# EAGLE design vario_1 (EAGLE 7.5.0)
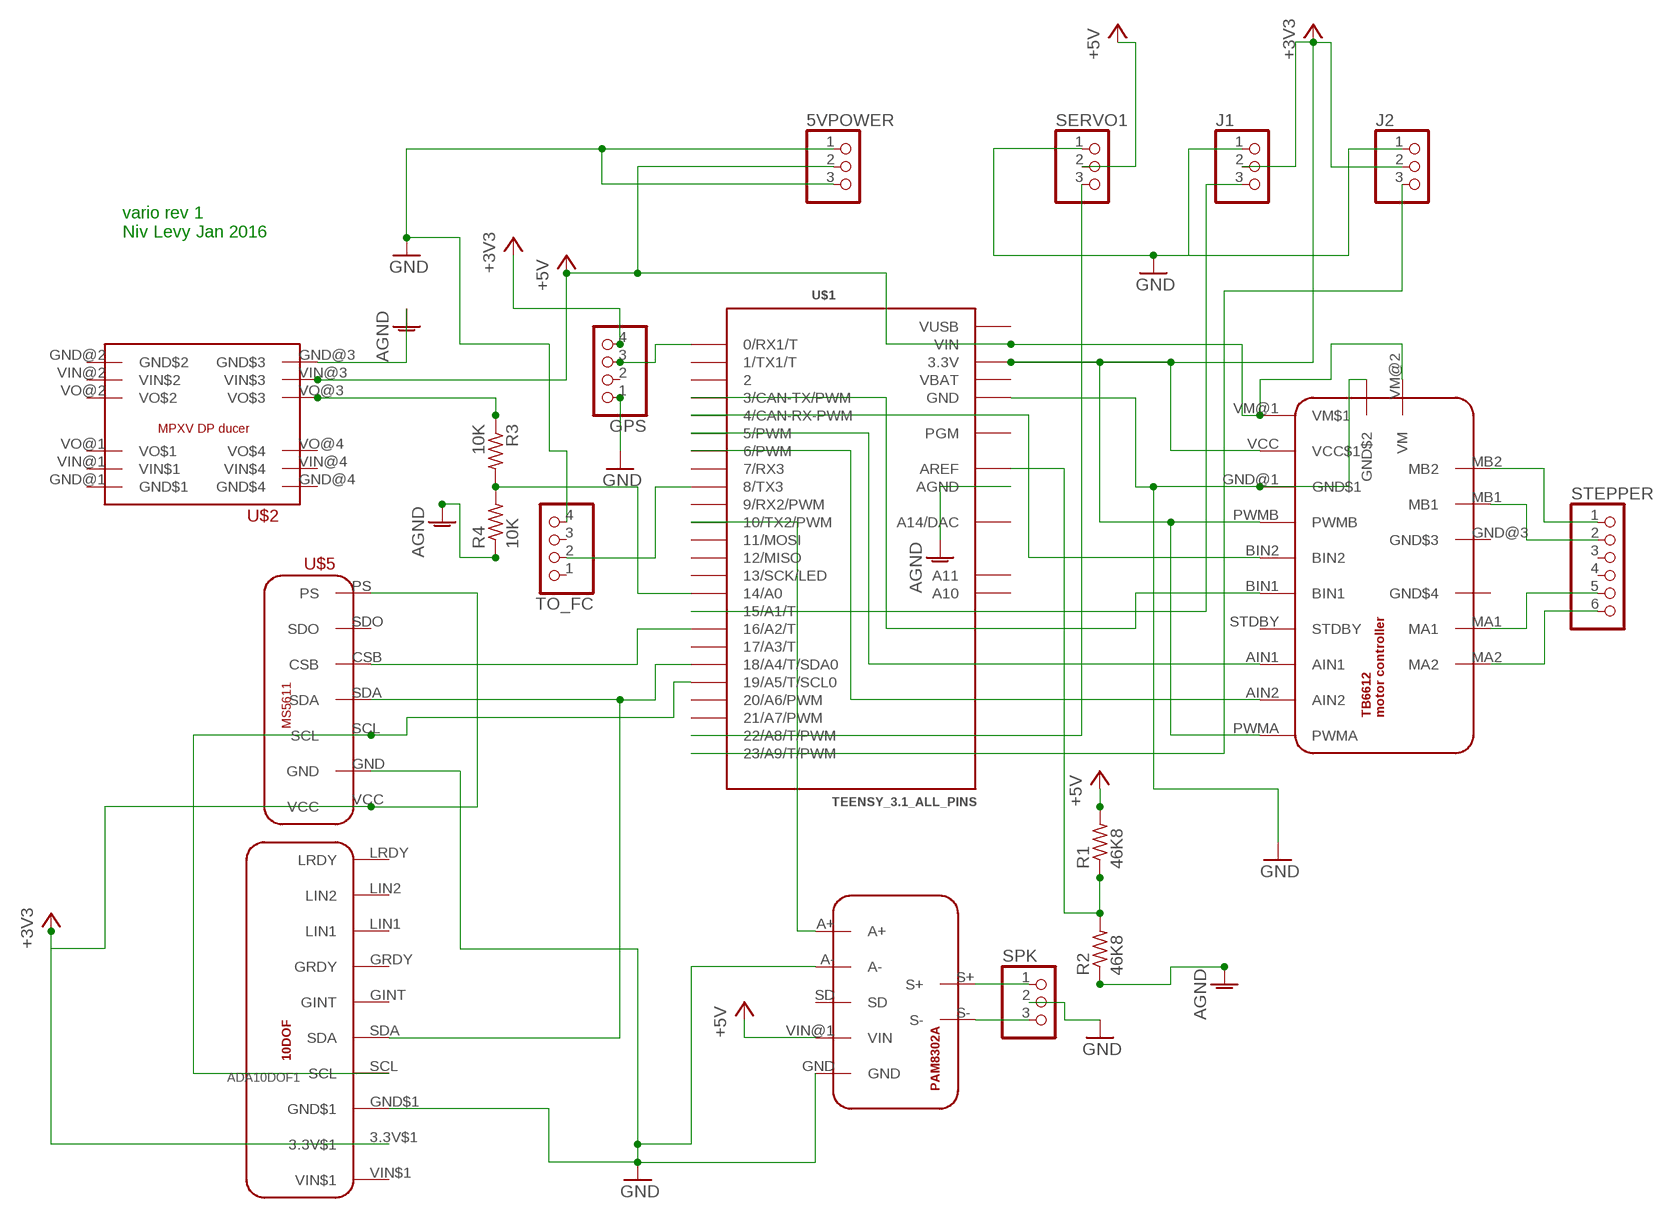
[diagram p0: schematic, sheet 1]

## Parts
5VPOWER  PINHD-1X3  [1X03]
ADA10DOF1  10DOF_BREAKOUT  [10_DOF_BREAKOUT]
GPS  PINHD-1X4  [1X04]
J1  PINHD-1X3  [1X03]
J2  PINHD-1X3  [1X03]
R1  46K8  R-US_0207/10  [0207/10]
R2  46K8  R-US_0207/10  [0207/10]
R3  10K  R-US_0207/10  [0207/10]
R4  10K  R-US_0207/10  [0207/10]
SERVO1  PINHD-1X3  [1X03]
SPK  PINHD-1X3  [1X03]
STEPPER  PINHD-1X6  [1X06]
TO_FC  PINHD-1X4  [1X04]
U$1  TEENSY_3.1_ALL_PINS  [TEENSY3-ALL_PINS]
U$2  MPXV  [MPXV]
U$3  TB6612_BREAKOUT  [TB6612_BREAKOUT]
U$4  PAM8302A_BREAKOUT  [PAM8302A_BREAKOUT]
U$5  MS5611_BREAKOUT  [MS5611_BREAKOUT]

## Nets
+3V3: ADA10DOF1.3.3V$1 GPS.4 J1.2 J2.2 U$1.3.3V U$1.3.3V1(3.3V) U$3.PWMA U$3.PWMB U$3.VCC(VCC$1) U$5.PS U$5.VCC
+5V: 5VPOWER.2 R1.2 SERVO1.2 U$1.VIN U$2.VIN@3(VIN$3) U$3.VM@1(VM$1) U$3.VM@2(VM) U$4.VIN@1(VIN)
AGND: R2.1 R4.1 U$1.AGND U$2.GND@3(GND$3)
GND: 5VPOWER.1 5VPOWER.3 ADA10DOF1.GND$1 GPS.1 J1.1 J2.1 SERVO1.1 SPK.2 TO_FC.4 U$1.GND U$1.GND1(GND) U$3.GND@1(GND$1) U$3.GND@2(GND$2) U$4.A- U$4.GND U$5.GND
N$1: STEPPER.1 U$3.MB2
N$2: STEPPER.2 U$3.MB1
N$3: STEPPER.6 U$3.MA2
N$4: STEPPER.5 U$3.MA1
N$5: U$1.16/A2(16/A2/T) U$5.CSB
N$8: U$1.6(6/PWM) U$3.AIN2
N$9: U$1.5(5/PWM) U$3.AIN1
N$10: U$1.4(4/CAN-RX-PWM) U$3.BIN2
N$11: U$1.3(3/CAN-TX/PWM) U$3.BIN1
N$12: ADA10DOF1.SDA U$1.18/A4(18/A4/T/SDA0) U$5.SDA
N$13: ADA10DOF1.SCL U$1.19/A5(19/A5/T/SCL0) U$5.SCL
N$14: R3.2 R4.2 U$1.14/A0
N$15: R1.1 R2.2 U$1.AREF
N$16: R3.1 U$2.VO@3(VO$3)
N$17: TO_FC.2 U$1.8(8/TX3)
N$18: U$1.10(10/TX2/PWM) U$4.A+
N$19: GPS.3 U$1.0(0/RX1/T)
N$20: SPK.1 U$4.S+
N$21: J1.3 U$1.15/A1(15/A1/T)
N$22: SERVO1.3 U$1.22/A8(22/A8/T/PWM)
N$23: J2.3 U$1.23/A9(23/A9/T/PWM)
N$24: SPK.3 U$4.S-
Unconnected: ADA10DOF1.GINT ADA10DOF1.GRDY ADA10DOF1.LIN1 ADA10DOF1.LIN2 ADA10DOF1.LRDY ADA10DOF1.VIN$1 GPS.2 STEPPER.3 STEPPER.4 TO_FC.1 TO_FC.3 U$1.1(1/TX1/T) U$1.2 U$1.7(7/RX3) U$1.9(9/RX2/PWM) U$1.11(11/MOSI) U$1.12(12/MISO) U$1.13(13/SCK/LED) U$1.17/A3(17/A3/T) U$1.20/A6(20/A6/PWM) U$1.21/A7(21/A7/PWM) U$1.A10 U$1.A11 U$1.PGM U$1.RESET/DAC(A14/DAC) U$2.GND@1(GND$1) U$2.GND@2(GND$2) U$2.GND@4(GND$4) U$2.VIN@1(VIN$1) U$2.VIN@2(VIN$2) U$2.VIN@4(VIN$4) U$2.VO@1(VO$1) U$2.VO@2(VO$2) U$2.VO@4(VO$4) U$3.GND@3(GND$3) U$3.GND@4(GND$4) U$3.STDBY U$4.SD U$5.SDO

## Notes on the sheet
- vario rev 1
  Niv Levy Jan 2016

## Power pins joined to a net without a drawn wire
VBAT: U$1.VBAT
VUSB: U$1.VUSB

## Library data of the parts
5VPOWER J1 J2 SERVO1 SPK = pinhead:PINHD-1X3: PIN HEADER
ADA10DOF1 = adafruit_breakout_boards:10DOF_BREAKOUT: adafruit 10dof breakout board see https://www.adafruit.com/product/1604
GPS TO_FC = pinhead:PINHD-1X4: PIN HEADER
R1-R4 = adafruit:R-US_: RESISTOR, American symbol
STEPPER = adafruit:PINHD-1X6: PIN HEADER
U$1 = Teensy_3_and_LC_Series_Boards_v1.1:TEENSY_3.1_ALL_PINS: Footprint for Teensy 3.1 or 3.2 board using all through-holes, i.e. the entire perimeter plus the 4 through-holes inboard (A10,A11,AREF, VUSB)
U$2 = moderdevice_breakout:MPXV
U$3 = adafruit_breakout_boards:TB6612_BREAKOUT: TB6612 motor driver breakout board - adafruit https://learn.adafruit.com/adafruit-tb6612-h-bridge-dc-stepper-motor-driver-breakout/overview
U$4 = adafruit_breakout_boards:PAM8302A_BREAKOUT
U$5 = ms5611_breakout:MS5611_BREAKOUT

## Board
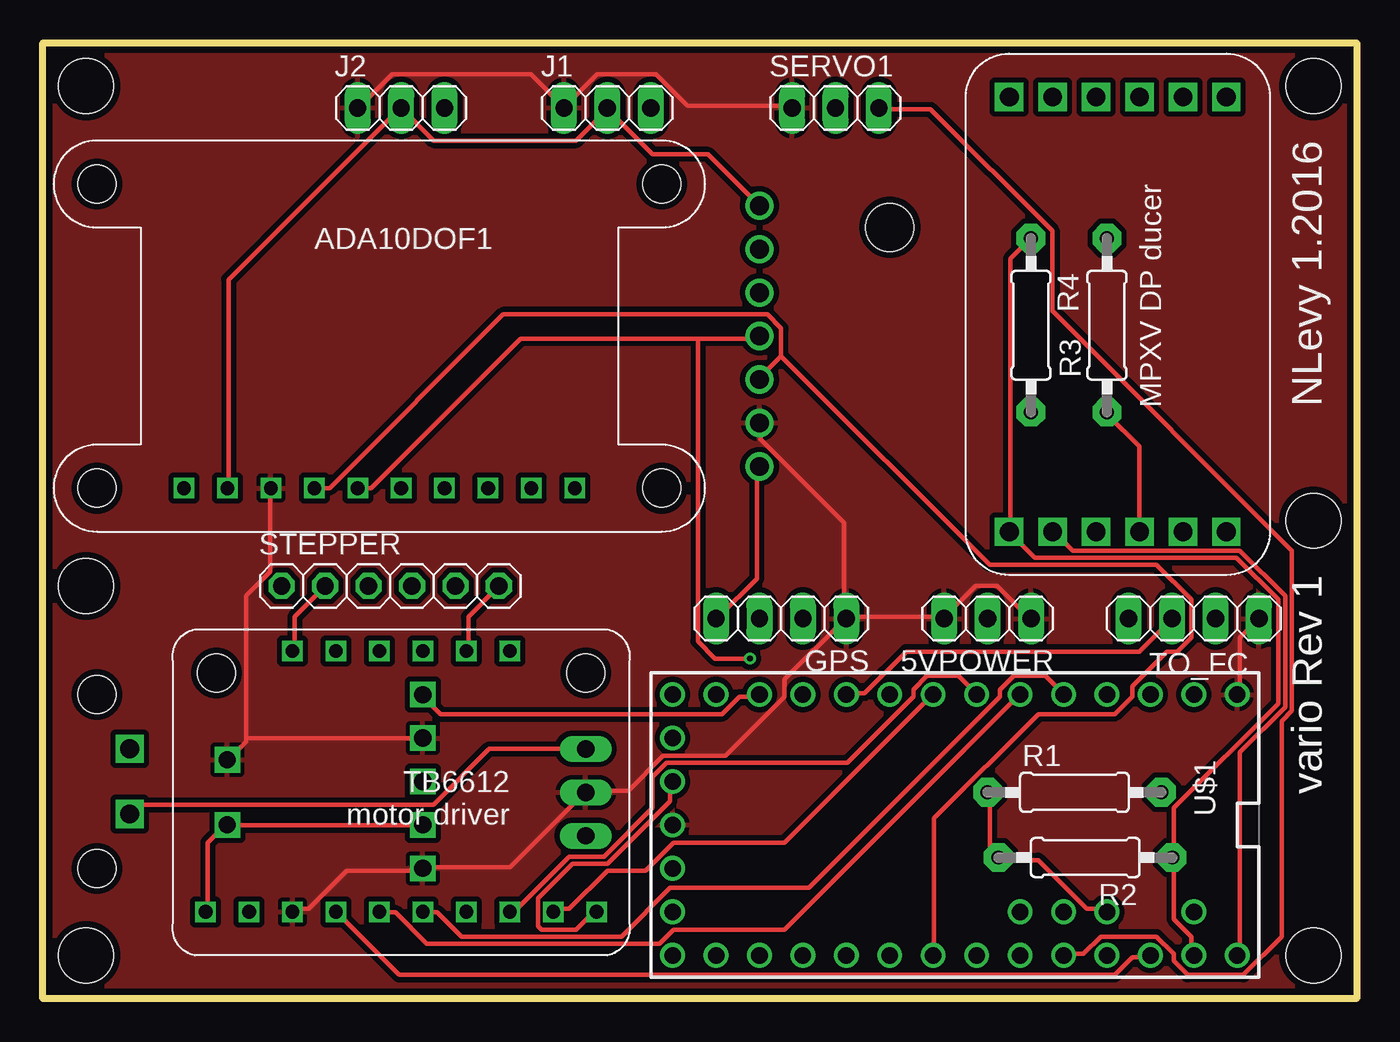
[diagram p1: board, top side]
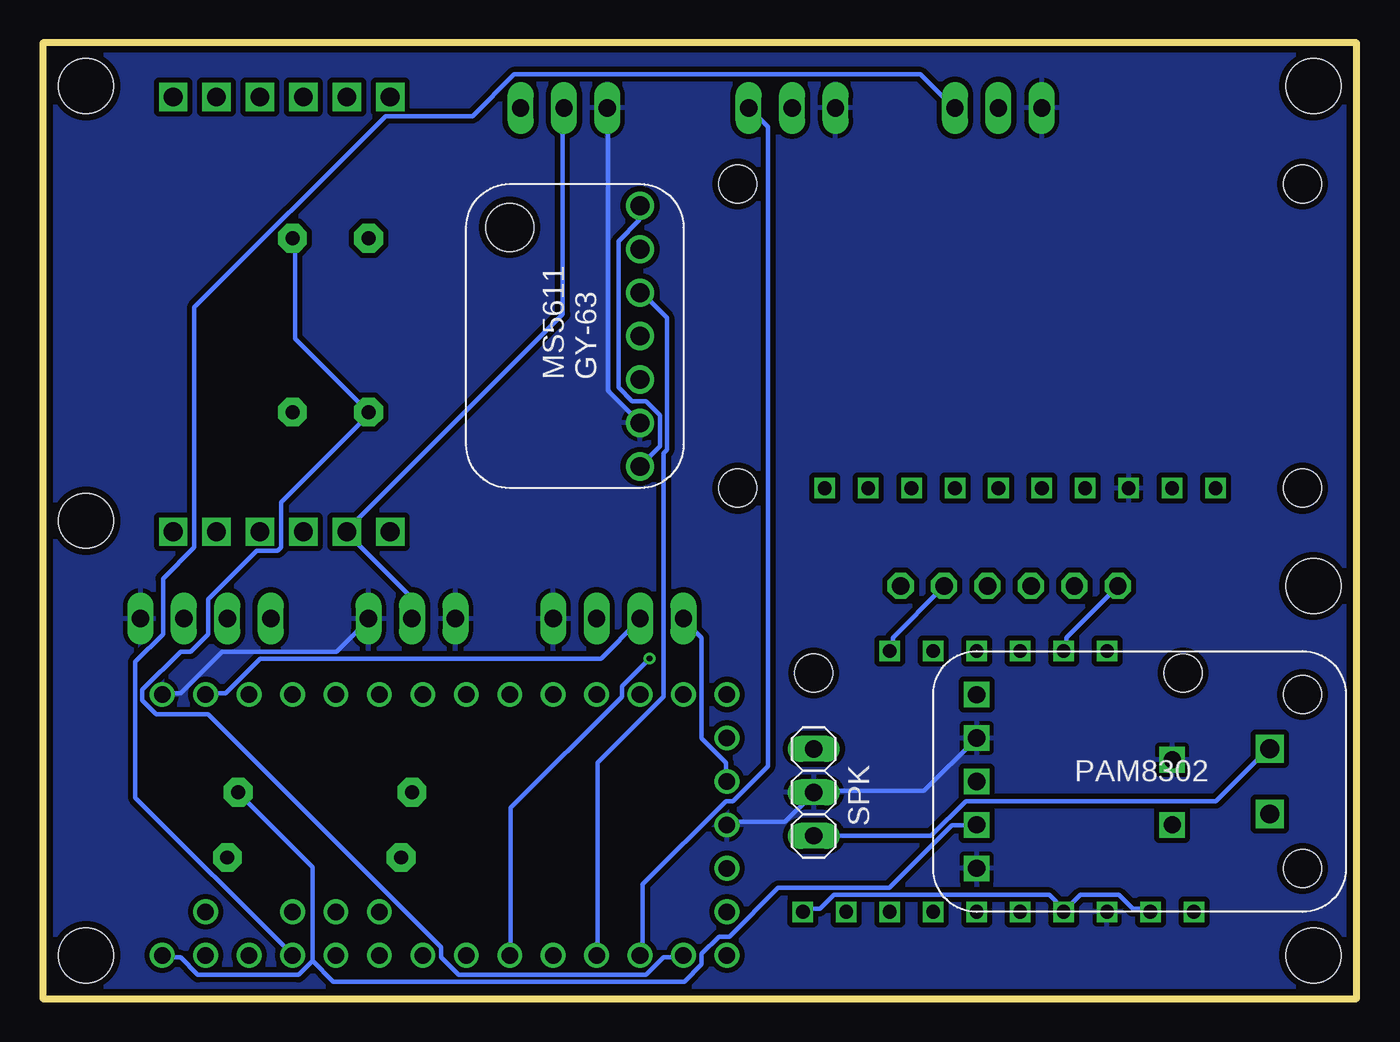
[diagram p2: board, bottom side, seen from below]

Size 76.83 x 55.88 mm. Coordinates in mm from the lower left corner, seen from the top.
Outline: 0,55.88 76.83,55.88 76.83,0 0,0 0,55.88
Copper layers (1*16): Top 0.0356mm / dielectric 1.5011mm / Bottom 0.0356mm
Design rules "oshpark-2layer *": minimum track width 10mil, minimum drill 13mil, track to track 6mil, track to pad 6mil, pad to pad 6mil, via to via 6mil, smd to smd 6mil, copper to edge 15mil, drill to drill 6mil, minimum pad ring 7mil, minimum via ring 7mil, stop-mask expansion 2.5mil, vias tented up to drill 0mil, thermal gap 10mil
Holes 3.2 mm at 2.54,53.34 2.54,24.13 74.3,2.54 2.54,2.54 74.3,53.34 74.3,27.94

### Footprints (pad centres in the part's own frame; a part is rotated, then mirrored left to right if it is on the bottom)
1X03 = drill 1.016 long: 1 -2.54,0; 2 0,0; 3 2.54,0
10_DOF_BREAKOUT = drill 0.8 square: 3.3V$1 -8.89,-8.89; GINT 1.27,-8.89; GND$1 -6.35,-8.89; GRDY 3.81,-8.89; LIN1 6.35,-8.89; LIN2 8.89,-8.89; LRDY 11.43,-8.89; SCL -3.81,-8.89; SDA -1.27,-8.89; VIN$1 -11.43,-8.89 | hole 2.2: -16.51,-8.89; -16.51,8.89; 16.51,-8.89; 16.51,8.89
1X04 = drill 1.016 long: 1 -3.81,0; 2 -1.27,0; 3 1.27,0; 4 3.81,0
0207/10 = drill 0.813 pad 1.676 octagon: 1 -5.08,0; 2 5.08,0
1X06 = drill 1.016 octagon: 1 -6.35,0; 2 -3.81,0; 3 -1.27,0; 4 1.27,0; 5 3.81,0; 6 6.35,0
TEENSY3-ALL_PINS = drill 0.965: 0 -7.62,13.97; 1 -7.62,11.43; 2 -7.62,8.89; 3 -7.62,6.35; 3.3V 7.62,11.43; 3.3V1 -2.54,-16.51; 4 -7.62,3.81; 5 -7.62,1.27; 6 -7.62,-1.27; 7 -7.62,-3.81; 8 -7.62,-6.35; 9 -7.62,-8.89; 10 -7.62,-11.43; 11 -7.62,-13.97; 12 -7.62,-16.51; 13 7.62,-16.51; 14/A0 7.62,-13.97; 15/A1 7.62,-11.43; 16/A2 7.62,-8.89; 17/A3 7.62,-6.35; 18/A4 7.62,-3.81; 19/A5 7.62,-1.27; 20/A6 7.62,1.27; 21/A7 7.62,3.81; 22/A8 7.62,6.35; 23/A9 7.62,8.89; A10 5.08,6.35; A11 5.08,3.81; AGND 7.62,13.97; AREF 5.08,8.89; GND -7.62,16.51; GND1 0,-16.51; PGM 2.54,-16.51; RESET/DAC 5.08,-16.51; VBAT -5.08,-16.51; VIN 7.62,16.51; VUSB 5.08,13.97
MPXV = drill 1.1 square: GND@1 -12.7,6.35; GND@2 -12.7,-6.35; GND@3 12.7,-6.35; GND@4 12.7,6.35; VIN@1 -12.7,3.81; VIN@2 -12.7,-3.81; VIN@3 12.7,-3.81; VIN@4 12.7,3.81; VO@1 -12.7,1.27; VO@2 -12.7,-1.27; VO@3 12.7,1.27; VO@4 12.7,-1.27
TB6612_BREAKOUT = drill 0.8 square: AIN1 -6.985,-6.35; AIN2 -6.985,-8.89; BIN1 -6.985,-1.27; BIN2 -6.985,1.27; GND@2 -6.985,6.35; GND@3 8.255,1.27; GND@4 8.255,-1.27; MA1 8.255,-6.35; MA2 8.255,-3.81; MB1 8.255,6.35; MB2 8.255,3.81; PWMA -6.985,-11.43; PWMB -6.985,3.81; STDBY -6.985,-3.81; VCC -6.985,8.89; VM@2 -6.985,11.43 | drill 1 square: GND@1 1.905,10.16; VM@1 -1.905,10.16 | hole 2.2: 6.985,10.795; 6.985,-10.795
PAM8302A_BREAKOUT = drill 1 square: A+ -9.525,5.08; A- -9.525,2.54; GND -9.525,-5.08; SD -9.525,0; VIN@1 -9.525,-2.54 | drill 1.1 square: S+ 7.62,1.905; S- 7.62,-1.905 | hole 2.2: 9.525,5.08; 9.525,-5.08
MS5611_BREAKOUT = drill 1.1: CSB 3.81,2.54; GND 3.81,-5.08; PS 3.81,7.62; SCL 3.81,-2.54; SDA 3.81,0; SDO 3.81,5.08; VCC 3.81,-7.62 | hole 2.8: -3.81,6.35

### Placement (x,y rotation side)
5VPOWER  55.25,22.23 180 top
ADA10DOF1  19.69,38.73 0 top
GPS  43.18,22.23 180 top
J1  33.02,52.07 0 top
J2  20.95,52.07 0 top
R1  60.33,12.07 0 top
R2  60.96,8.26 180 top
R3  62.23,39.37 90 top
R4  57.78,39.37 270 top
SERVO1  46.36,52.07 0 top
SPK  31.75,12.07 90 bottom
STEPPER  20.32,24.13 0 top
TO_FC  67.31,22.23 0 top
U$1  53.34,10.16 270 top
U$2  62.86,40.01 270 top
U$3  20.95,12.07 90 top
U$4  12.7,12.7 0 bottom
U$5  45.72,38.73 0 bottom

### Tracks (layer width: path | path; a pad name or v marks a point on that pad's centre or on a via)
+3V3
  Top 0.254: 33.02,51.99 35.66,49.35 38.91,49.35 U$5.PS | ADA10DOF1.3.3V$1 10.87,29.84 10.87,42.04 20.83,51.99 J2.2 22.86,50.17 31.19,50.17 33.02,51.99 | 33.02,51.99 J1.2 | U$5.VCC 41.76,31.06 41.76,24.56 39.52,22.33 GPS.4 | U$3.PWMB 20.83,1.4 62.69,1.4 63.7,2.41 64.72,2.41 U$1.3.3V | U$1.3.3V1 36.68,12.57 36.68,11.56 33.02,7.9 30.99,7.9 28.96,5.87 28.96,4.24 29.16,4.04 31.19,4.04 32.21,5.06 U$3.PWMA
  Bottom 0.254: U$1.3.3V1 36.88,12.78 36.88,13.79 38.3,15.22 38.3,21.11 39.32,22.12 GPS.4 | U$3.VCC 12.09,5.26 13.11,5.26 13.92,6.07 16.15,6.07 U$3.PWMB 17.17,5.26 17.98,6.07 30.58,6.07 31.39,5.26 32.21,5.26 U$3.PWMA | U$5.VCC 40.74,32.28 40.74,34.11 41.55,34.93 42.37,34.93 43.18,35.74 43.18,44.27 41.96,45.49 41.96,46.3 U$5.PS
+5V
  Top 0.254: U$3.VM@2 9.65,5.26 9.65,9.12 10.67,10.14 U$3.VM@1 10.87,10.14 22.05,10.14 U$4.VIN@1 | U$1.VIN 70,2.62 70,14.4 72.64,17.04 72.64,23.55 70,26.19 60.25,26.19 59.23,27.2 U$2.VIN@3
  Bottom 0.254: 61.06,2.21 61.87,1.4 67.77,1.4 68.78,2.41 69.8,2.41 U$1.VIN | 61.06,2.21 61.06,7.7 65.33,11.96 R1.2 | 5VPOWER.2 55.37,22.33 55.37,23.55 59.03,27.2 U$2.VIN@3 59.03,27.41 46.43,40.01 46.43,51.99 SERVO1.2 | 61.06,2.21 59.84,0.99 39.32,0.99 38.3,2.01 38.3,2.62 37.29,3.63 36.68,3.63 33.83,6.48 27.33,6.48 23.67,10.14 22.25,10.14 U$4.VIN@1
AGND
  Top 0.254: U$1.AGND 67.16,2.62 67.16,3.63 66.14,4.65 66.14,8.1 R2.1 66.14,8.31 66.14,11.15 72.24,17.25 72.24,23.34 69.8,25.78 58.01,25.78 56.59,27.2 U$2.GND@3 56.59,27.41 56.59,43.26 R4.1
GND
  Top 0.254: U$3.GND@2 14.73,5.26 15.55,5.26 17.78,7.49 22.05,7.49 U$4.GND 22.25,7.7 27.33,7.7 31.6,11.96 SPK.2 31.8,12.17 34.24,12.17 36.27,14.2 39.93,14.2 43.38,17.65 43.38,18.67 46.84,22.12 GPS.1 | 11.89,15.22 11.89,15.01 10.87,14 U$3.GND@1 | 11.89,15.22 11.89,23.55 13.31,24.97 13.31,29.84 ADA10DOF1.GND$1 | 11.89,15.22 22.05,15.22 U$4.A- | J2.1 18.59,52.2 20.42,54.03 28.55,54.03 30.38,52.2 J1.1 30.58,52.2 32.41,54.03 35.87,54.03 37.69,52.2 43.79,52.2 SERVO1.1 | TO_FC.4 70,21.11 70,17.86 U$1.GND | GPS.1 47.04,22.33 52.53,22.33 5VPOWER.3 52.73,22.33 54.56,24.16 55.78,24.16 57.61,22.33 5VPOWER.1 | U$5.GND 41.96,33.5 41.96,32.69 46.84,27.81 46.84,22.33 GPS.1
  Bottom 0.254: U$1.GND1 36.68,10.34 33.43,10.34 31.8,11.96 SPK.2 31.6,12.17 25.3,12.17 U$4.A- | U$1.GND 69.8,17.86 68.78,17.86 66.34,20.3 59.64,20.3 57.81,22.12 5VPOWER.1 | U$5.GND 43.79,35.54 43.79,51.99 SERVO1.1
  pour Top (isolate 0.305): 0,55.88 76.83,55.88 76.83,0 0,0
  pour Bottom (isolate 0.305): 0,55.88 76.83,55.88 76.83,0 0,0
N$1
  Bottom 0.254: U$3.MB2 16.97,20.5 16.97,21.11 14.12,23.95 STEPPER.1
N$2
  Top 0.254: U$3.MB1 14.73,20.5 14.73,22.33 16.36,23.95 STEPPER.2
N$3
  Top 0.254: U$3.MA2 24.89,20.5 24.89,22.33 26.52,23.95 STEPPER.6
N$4
  Bottom 0.254: U$3.MA1 27.13,20.5 27.13,21.11 24.28,23.95 STEPPER.5
N$5
  Bottom 0.254: U$1.16/A2 44.4,2.62 44.4,13.79 40.54,17.65 40.54,31.88 40.34,32.08 40.34,39.8 41.76,41.22 U$5.CSB
N$8
  Top 0.254: U$3.AIN2 29.97,5.26 30.79,5.26 33.02,7.49 35.26,7.49 36.88,9.12 43.38,9.12 51.92,17.65 U$1.6
N$9
  Top 0.254: U$3.AIN1 27.33,5.26 27.74,5.26 30.79,8.31 32.82,8.31 35.66,11.15 35.66,12.98 36.47,13.79 47.04,13.79 50.9,17.65 50.9,18.06 51.71,18.87 53.54,18.87 54.56,17.86 U$1.5
N$10
  Top 0.254: U$3.BIN2 19.81,5.06 20.62,5.06 22.45,3.23 36.07,3.23 36.88,4.04 43.38,4.04 57,17.65 U$1.4
N$11
  Top 0.254: U$3.BIN1 22.25,5.06 23.06,5.06 24.49,3.63 33.83,3.63 36.68,6.48 44.81,6.48 55.98,17.65 55.98,18.06 56.79,18.87 58.62,18.87 59.64,17.86 U$1.3
N$12  (via drill 0.33)
  Top 0.254: ADA10DOF1.SDA 19.2,29.84 27.94,38.58 38.3,38.58 | 38.3,38.58 41.76,38.58 U$5.SDA | v41.35,19.89 39.32,19.89 38.3,20.9 38.3,38.58
  Bottom 0.254: v41.35,19.89 42.98,18.26 42.98,17.65 49.48,11.15 49.48,2.62 U$1.18/A4
N$13
  Top 0.254: ADA10DOF1.SCL 16.76,29.84 26.92,40.01 42.37,40.01 43.18,39.19 43.18,37.57 | 43.18,37.57 41.96,36.35 U$5.SCL | 43.18,37.57 55.37,25.38 65.13,25.38 67.16,23.34 67.16,21.11 66.34,20.3 65.73,20.3 63.7,18.26 63.7,17.65 62.69,16.64 58.22,16.64 52.12,10.54 52.12,2.62 U$1.19/A5
N$14
  Bottom 0.254: U$1.14/A0 39.52,2.41 40.54,2.41 41.55,1.4 52.53,1.4 53.54,2.41 53.54,3.02 67.16,16.64 70.21,16.64 71.02,17.45 71.02,18.06 68.78,20.3 68.17,20.3 67.16,21.31 67.16,23.34 64.31,26.19 63.09,26.19 62.89,26.39 62.89,29.03 57.81,34.11 R4.2 62.08,38.58 62.08,44.27 R3.2
N$15
  Top 0.254: U$1.AREF 62.08,5.26 61.06,5.26 58.22,8.1 55.98,8.1 R2.2 55.78,8.31 55.37,8.71 55.37,11.96 R1.1
N$16
  Top 0.254: U$2.VO@3 64.11,27.41 64.11,32.28 62.28,34.11 R3.1
N$17
  Top 0.254: TO_FC.2 64.11,20.3 50.5,20.3 48.06,17.86 47.04,17.86 U$1.8
N$18
  Top 0.254: U$1.10 41.76,17.65 40.74,17.65 39.73,16.64 23.27,16.64 22.25,17.65 U$4.A+
N$19
  Bottom 0.254: U$1.0 67.16,17.86 66.14,17.86 64.11,19.89 44.2,19.89 41.96,22.12 GPS.3
N$20
  Bottom 0.254: SPK.1 24.89,9.53 22.86,11.56 8.23,11.56 5.18,14.61 U$4.S+
N$21
  Bottom 0.254: U$1.15/A1 41.76,2.62 41.76,6.68 36.88,11.56 36.47,11.56 34.44,13.59 34.44,50.98 35.46,51.99 J1.3
N$22
  Top 0.254: U$1.22/A8 59.84,2.62 60.86,2.62 61.87,3.63 65.13,3.63 66.14,2.62 66.14,2.21 66.95,1.4 70.21,1.4 72.44,3.63 72.44,16.23 73.05,16.84 73.05,26.19 59.03,40.21 59.03,44.88 51.92,51.99 49.07,51.99 SERVO1.3
N$23
  Bottom 0.254: U$1.23/A9 62.28,2.62 71.42,11.76 71.42,19.69 69.8,21.31 69.8,24.56 67.97,26.39 67.97,40.41 56.79,51.59 51.71,51.59 49.28,54.03 25.5,54.03 23.67,52.2 J2.3
N$24
  Top 0.254: SPK.3 26.11,14.61 22.86,11.35 5.59,11.35 5.18,10.95 U$4.S-

### Text on the board
tPlace: NLevy 1.2016 | vario Rev 1